# EAGLE design MO01 (EAGLE 6.3)
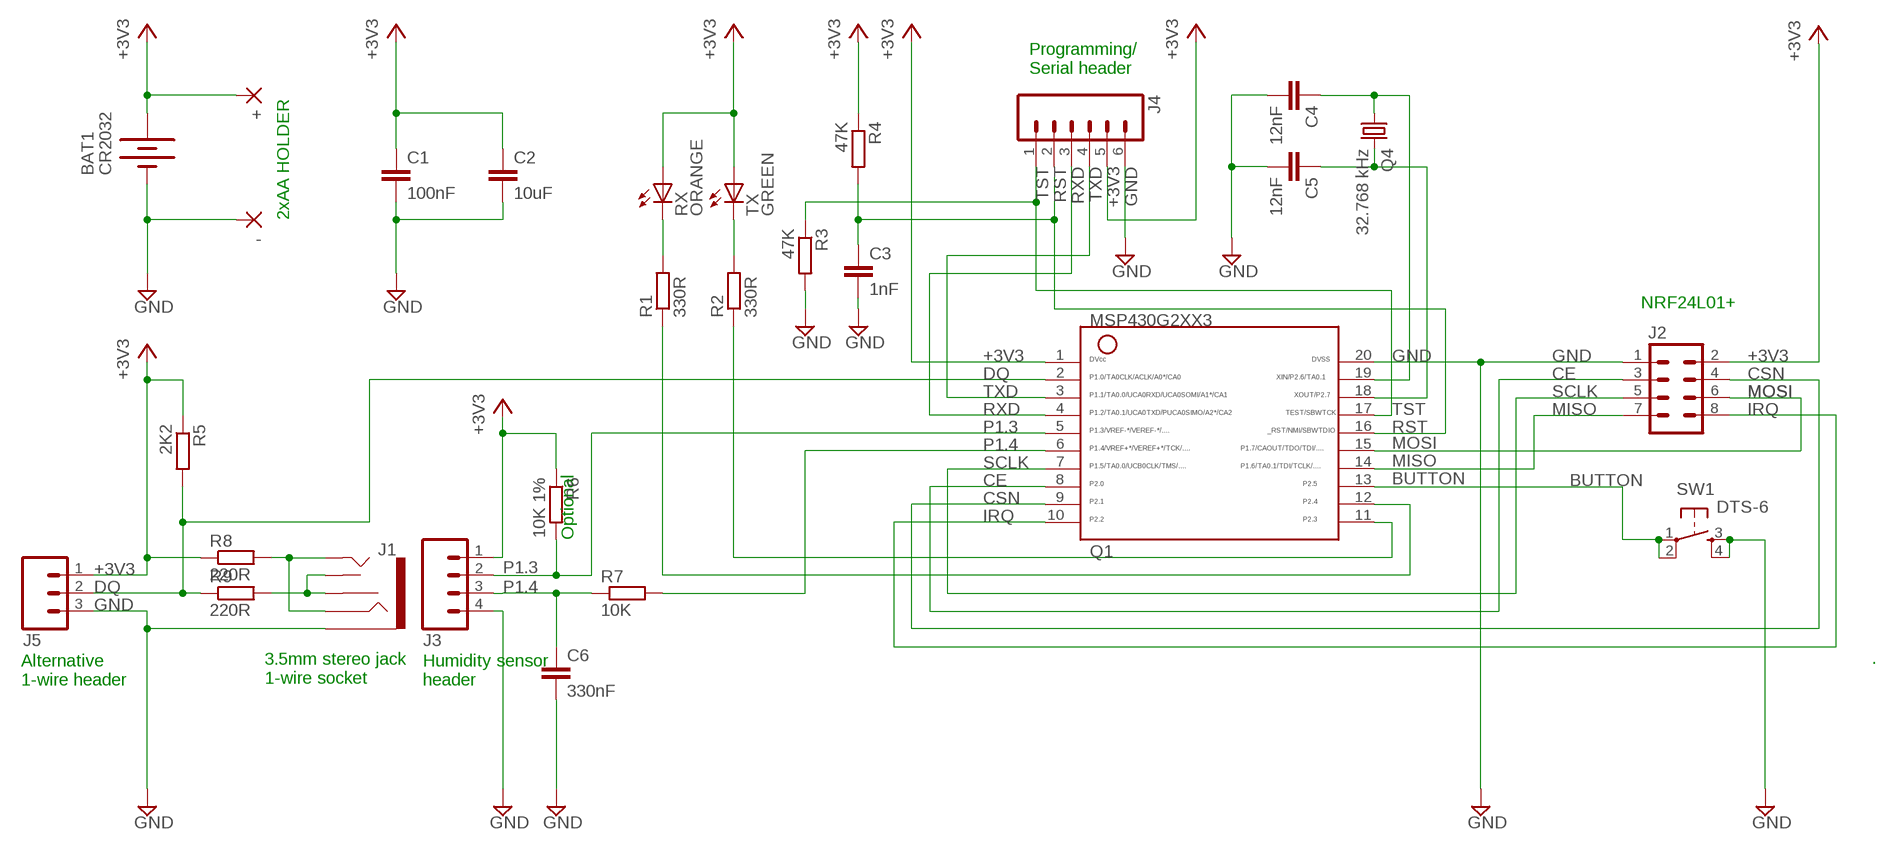
[diagram p0: schematic, sheet 1]

## Parts
+  2,54/1,0  [2,54/1,0]
-  2,54/1,0  [2,54/1,0]
BAT1  CR2032  BATTERY20PTH  [BATTCOM_20MM_PTH]
C1  100nF  C-EUC0805  [C0805]
C2  10uF  C-EUC1206  [C1206]
C3  1nF  C-EUC0805  [C0805]
C4  12nF  C-EUC0805  [C0805]
C5  12nF  C-EUC0805  [C0805]
C6  330nF  C-EUC0805  [C0805]
J1  AUDIO-JACK2PTH  [AUDIO-JACK]
J2  M04X2  [2X4]
J3  M04PTH  [1X04]
J4  M06SIP  [1X06]
J5  M03PTH  [1X03]
Q1  G2XX3---PW20  [PW20]
Q4  32.768 kHz  CRYSTALTC38H  [TC38H]
R1  330R  R-EU_M0805  [M0805]
R2  330R  R-EU_M0805  [M0805]
R3  47K  R-EU_M0805  [M0805]
R4  47K  R-EU_M0805  [M0805]
R5  2K2  R-EU_M0805  [M0805]
R6  10K 1%  R-EU_M0805  [M0805]
R7  10K  R-EU_M0805  [M0805]
R8  220R  R-EU_M0805  [M0805]
R9  220R  R-EU_M0805  [M0805]
RX  ORANGE  LEDCHIPLED_0805  [CHIPLED_0805]
SW1  DTS-6  [DTS-6]
TX  GREEN  LEDCHIPLED_0805  [CHIPLED_0805]

## Nets
+3V3: +.1(P) BAT1.1(+) C1.1 C2.1 J2.2 J3.1 J4.5 J5.1 Q1.1 R4.1 R5.1 R6.1 R8.1 RX.A TX.A
BUTTON: Q1.13 SW1.1 SW1.2
CE: J2.3 Q1.8
CSN: J2.4 Q1.9
DQ: J5.2 Q1.2 R5.2 R9.1
GND: -.1(P) BAT1.2(-) C1.2 C2.2 C3.2 C4.2 C5.2 C6.2 J1.SLEEVE J2.1 J3.4 J4.6 J5.3 Q1.20 R3.2 SW1.3 SW1.4
IRQ: J2.8 Q1.10
MISO: J2.7 Q1.14
MOSI: J2.6 Q1.15
N$1: R2.2 TX.C
N$2: R1.2 RX.C
N$3: Q1.11 R2.1
N$4: J1.RSH J1.TSH R9.2
N$5: Q1.12 R1.1
N$6: J1.RING J1.TIP R8.2
N$7: C6.1 J3.3 R7.1
P1.3: J3.2 Q1.5 R6.2
P1.4: Q1.6 R7.2
P2.6: C4.1 Q1.19 Q4.1
P2.7: C5.1 Q1.18 Q4.2
RST: C3.1 J4.2 Q1.16 R4.2
RXD: J4.3 Q1.4
SCLK: J2.5 Q1.7
TST: J4.1 Q1.17 R3.1
TXD: J4.4 Q1.3

## Notes on the sheet
- Programming/
  Serial header
- 2xAA HOLDER
- NRF24L01+
- Optional
- .
- 3.5mm stereo jack
  1-wire socket
- Alternative
  1-wire header
- Humidity sensor 
  header

## Library data of the parts
+ - = wirepad:2,54/1,0: THROUGH-HOLE PAD
BAT1 = SparkFun:BATTERY: Battery Holders Various common sizes : AA, AAA, 20mm coin cell and 12mm coin cell.
C1 C3-C6 = resistor:C-EU: CAPACITOR, European symbol
C2 = rcl:C-EU: CAPACITOR, European symbol
J1 = SparkFun-Connectors:AUDIO-JACK2: Stereo audio jack with bypass switches.
J2 = SparkFun:M04X2
J3 = SparkFun:M04: Header 4 Standard 4-pin 0.1" header. Use with straight break away headers (SKU : PRT-00116), right angle break away headers (PRT-00553), swiss pins (PRT-00743), machine pins (PRT-00117), and female headers (PRT-00115). Molex polarized connector foot print use with SKU : PRT-08231 with associated crimp pins and housings. 1MM SMD Version SKU: PRT-10208
J4 = SparkFun:M06: Header 6 Standard 6-pin 0.1" header. Use with straight break away headers (SKU : PRT-00116), right angle break away headers (PRT-00553), swiss pins (PRT-00743), machine pins (PRT-00117), and female headers (PRT-00115). Molex polarized connector foot print use with SKU : PRT-08094 with associated crimp pins and housings. NOTES ON THE VARIANTS LOCK and LOCK_LONGPADS... This footprint was designed to help hold the alignment of a through-hole component (i.e. 6-pin header) while soldering it into place. You may notice that each hole has been shifted either up or down by 0.005 of an inch from it's more standard position (which is a perfectly straight line). This slight alteration caused the pins (the squares in the middle) to touch the edges of the holes. Because they are alternating, it causes a "brace" to hold the component in place. 0.005 has proven to be the perfect amount of "off-center" position when using our standard breakaway headers. Although looks a little odd when you look at the bare footprint, once you have a header in there, the alteration is very hard to notice. Also, if you push a header all the way into place, it is covered up entirely on the bottom side. This idea of altering the position of holes to aid alignment will be further integrated into the Sparkfun Library for other footprints. It can help hold any component with 3 or more connection pins.
J5 = SparkFun:M03: Header 3 Standard 3-pin 0.1" header. Use with straight break away headers (SKU : PRT-00116), right angle break away headers (PRT-00553), swiss pins (PRT-00743), machine pins (PRT-00117), and female headers (PRT-00115). Molex polarized connector foot print use with SKU : PRT-08232 with associated crimp pins and housings.
Q1 = TI_MSP430_v16:G2XX3---PW20: MSP430G2XX1 TSSOP (PW) 20 Pin Package
Q4 = crystal:CRYSTAL: CRYSTAL; OC_FARNELL: unknown; OC_NEWARK: unknown
R1-R9 = resistor:R-EU_: RESISTOR, European symbol; RESISTANCE: 4K7
RX TX = led:LED: LED OSRAM: - CHIPLED LG R971, LG N971, LY N971, LG Q971, LY Q971, LO R971, LY R971 LH N974, LH R974 LS Q976, LO Q976, LY Q976 LO Q996 - Hyper CHIPLED LW Q18S LB Q993, LB Q99A, LB R99A - SideLED LS A670, LO A670, LY A670, LG A670, LP A670 LB A673, LV A673, LT A673, LW A673 LH A674 LY A675 LS A676, LA A676, LO A676, LY A676, LW A676 LS A679, LY A679, LG A679 - Hyper Micro SIDELED® LS Y876, LA Y876, LO Y876, LY Y876 LT Y87S - SmartLED LW L88C, LW L88S LB L89C, LB L89S, LG L890 LS L89K, LO L89K, LY L89K LS L896, LA L896, LO L896, LY L896 - TOPLED LS T670, LO T670, LY T670, LG T670, LP T670 LSG T670, LSP T670, LSY T670, LOP T670, LYG T670 LG T671, LOG T671, LSG T671 LB T673, LV T673, LT T673, LW T673 LH T674 LS T676, LA T676, LO T676, LY T676, LB T676, LH T676, LSB T676, LW T676 LB T67C, LV T67C, LT T67C, LS T67K, LO T67K, LY T67K, LW E67C LS E67B, LA E67B, LO E67B, LY E67B, LB E67C, LV E67C, LT E67C LW T67C LS T679, LY T679, LG T679 LS T770, LO T770, LY T770, LG T770, LP T770 LB T773, LV T773, LT T773, LW T773 LH T774 LS E675, LA E675, LY E675, LS T675 LS T776, LA T776, LO T776, LY T776, LB T776 LHGB T686 LT T68C, LB T68C - Hyper Mini TOPLED® LB M676 - Mini TOPLED Santana® LG M470 LS M47K, LO M47K, LY M47K Source: http://www.osram.convergy.de LUXEON: - LUMILED® LXK2-PW12-R00, LXK2-PW12-S00, LXK2-PW14-U00, LXK2-PW14-V00 LXK2-PM12-R00, LXK2-PM12-S00, LXK2-PM14-U00 LXK2-PE12-Q00, LXK2-PE12-R00, LXK2-PE12-S00, LXK2-PE14-T00, LXK2-PE14-U00 LXK2-PB12-K00, LXK2-PB12-L00, LXK2-PB12-M00, LXK2-PB14-N00, LXK2-PB14-P00, LXK2-PB14-Q00 LXK2-PR12-L00, LXK2-PR12-M00, LXK2-PR14-Q00, LXK2-PR14-R00 LXK2-PD12-Q00, LXK2-PD12-R00, LXK2-PD12-S00 LXK2-PH12-R00, LXK2-PH12-S00 LXK2-PL12-P00, LXK2-PL12-Q00, LXK2-PL12-R00 Source: www.luxeon.com KINGBRIGHT: KA-3528ASYC Source: www.kingbright.com
SW1 = switch-tact:DTS-6

## Board
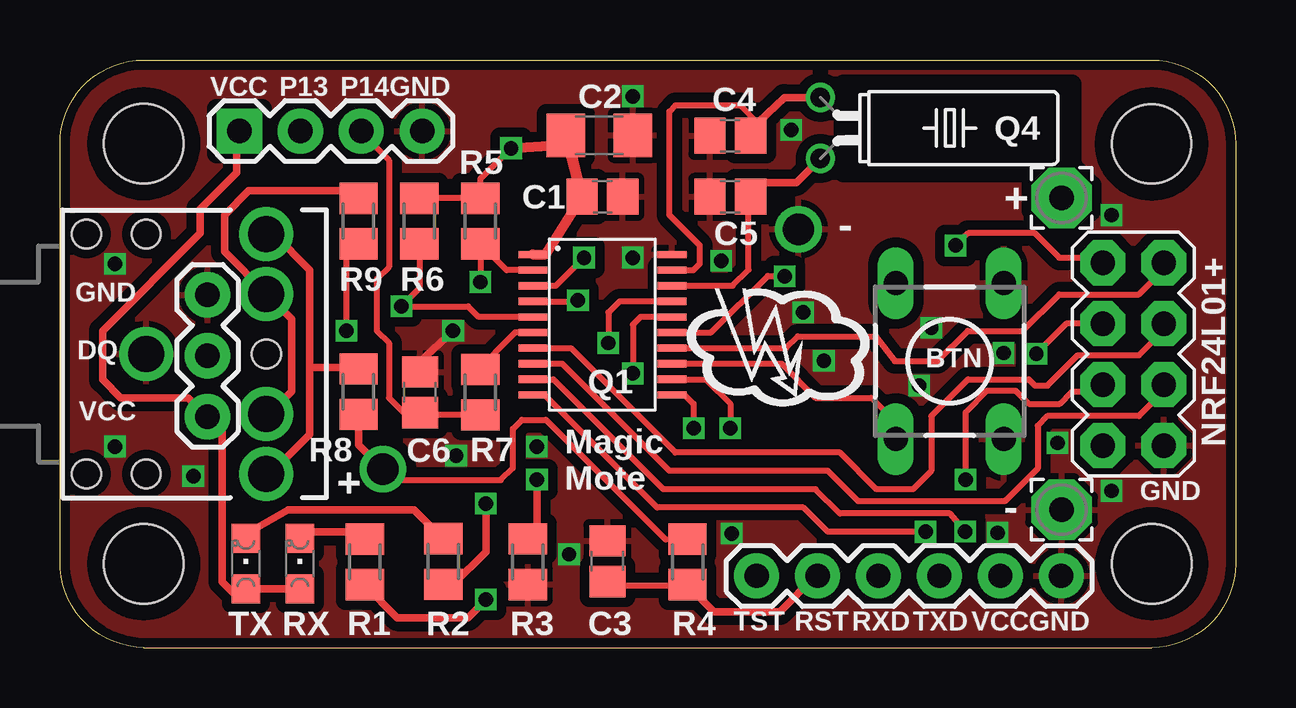
[diagram p1: board, top side]
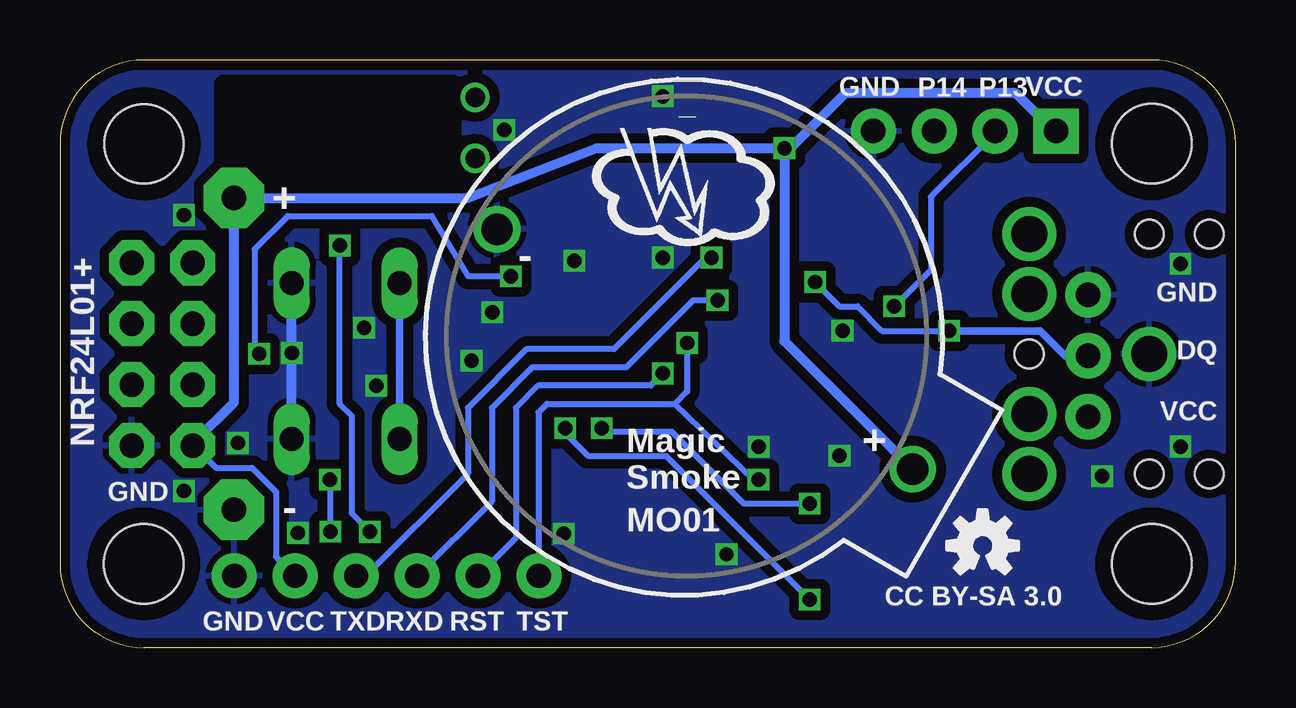
[diagram p2: board, bottom side, seen from below]

Size 49 x 24.5 mm. Coordinates in mm from the lower left corner, seen from the top.
Outline: 3.49,0 3.5,0
Outline: 3.5,0 45.5,0
Outline: 45.5,0 45.51,0
Outline: 0,3.49 0,3.6
Outline: 0,3.6 0,21
Outline: 0,21 0,21.01
Outline: 3.5,0 arc-90 0,3.6
Outline: 0,21 arc-90 3.5,24.5 45.5,24.5 arc-90 49,21 49,3.5 arc-90 45.5,0
Copper layers (1*2*15*16): Top 0.035mm / dielectric 0.2mm / layer 2 0.0175mm / dielectric 1.1mm / layer 15 0.0175mm / dielectric 0.2mm / Bottom 0.035mm
Design rules "SeeedStudio_DRU_no_angle_20130527": minimum track width 6mil, minimum drill 12mil, track to track 6mil, track to pad 6mil, pad to pad 6mil, via to via 6mil, smd to smd 0mil, copper to edge 10mil, drill to drill 10mil, minimum pad ring 6mil, minimum via ring 6mil, stop-mask expansion 2mil, vias tented up to drill 25mil, thermal gap 10mil
tRestrict: area 32.6,19.8 to 42.2,23.5
bRestrict: area 32.6,19.8 to 42.2,23.5

### Footprints (pad centres in the part's own frame; a part is rotated, then mirrored left to right if it is on the bottom)
2,54/1,0 = drill 1.016 pad 2.54 octagon: 1 0,0
BATTCOM_20MM_PTH = drill 1.3: 1 20,0; 2 0,0
C0805 = smd 1.3 x 1.5: 1 -0.85,0; 2 0.85,0
C1206 = smd 1.6 x 1.8: 1 -1.4,0; 2 1.4,0
AUDIO-JACK = drill 1.5 pad 2.184: RING 5,5; RSH 5,2.5; SLEEVE 0,0; TIP 5,-5; TSH 5,-2.5 | hole 1.2: 0,5; -2.5,5; -2.5,-5; 0,-5; 5,0
2X4 = drill 1.016 pad 1.88 octagon: 1 -3.81,-1.27; 2 -3.81,1.27; 3 -1.27,-1.27; 4 -1.27,1.27; 5 1.27,-1.27; 6 1.27,1.27; 7 3.81,-1.27; 8 3.81,1.27
1X04 = drill 1.016 pad 1.88 square: 1 0,0 | drill 1.016 pad 1.88: 2 2.54,0; 3 5.08,0; 4 7.62,0
1X06 = drill 1.016 pad 1.88: 1 0,0; 2 2.54,0; 3 5.08,0; 4 7.62,0; 5 10.16,0; 6 12.7,0
1X03 = drill 1.016 pad 1.88: 1 0,0; 2 2.54,0; 3 5.08,0
PW20 = smd 0.3 x 1.2: 1 -2.925,-2.9; 2 -2.275,-2.9; 3 -1.625,-2.9; 4 -0.975,-2.9; 5 -0.325,-2.9; 6 0.325,-2.9; 7 0.975,-2.9; 8 1.625,-2.9; 9 2.275,-2.9; 10 2.925,-2.9; 11 2.925,2.9; 12 2.275,2.9; 13 1.625,2.9; 14 0.975,2.9; 15 0.325,2.9; 16 -0.325,2.9; 17 -0.975,2.9; 18 -1.625,2.9; 19 -2.275,2.9; 20 -2.925,2.9
TC38H = drill 0.813: 1 -1.27,0; 2 1.27,0
M0805 = smd 1.3 x 1.6: 1 -0.95,0; 2 0.95,0
CHIPLED_0805 = smd 1.2 x 1.2: A 0,-1.05; C 0,1.05
DTS-6 = drill 1 long: 1 -3.25,2.25; 2 3.25,2.25; 3 -3.25,-2.25; 4 3.25,-2.25
STAND-OFF = hole 3.302: 0,0

### Placement (x,y rotation side)
+  41.75,18.75 0 top
-  41.75,5.75 0 top
BAT1  30.78,17.44 330 bottom
C1  22.61,18.8 0 top
C2  22.48,21.36 0 top
C3  22.82,3.6 90 top
C4  27.94,21.34 180 top
C5  27.94,18.8 180 top
C6  15,10.64 90 top
J1  3.6,12.24 0 top
J2  44.74,12.23 90 top
J3  7.48,21.54 0 top
J4  29.04,2.99 0 top
J5  6.15,9.63 90 top
Q1  22.61,13.46 270 top
Q4  31.7,21.66 270 top
R1  12.71,3.57 90 top
R2  15.97,3.59 90 top
R3  19.5,3.58 270 top
R4  26.16,3.57 270 top
R5  17.53,17.78 270 top
R6  14.99,17.78 270 top
R7  17.53,10.64 90 top
R8  12.45,10.67 90 top
R9  12.45,17.78 90 top
RX  10,3.5 0 top
SW1  37.08,11.94 90 top
TX  7.75,3.5 0 top
U$1  [OSHW-LOGO-S]  10.54,4.25 0 bottom
U$2  [STAND-OFF]  45.51,3.49 0 top
U$3  [STAND-OFF]  3.49,3.49 0 top
U$4  [STAND-OFF]  3.49,21.01 0 top
U$5  [STAND-OFF]  45.5,21 0 top

### Tracks (layer width: path | path; a pad name or v marks a point on that pad's centre or on a via)
+3V3  (via drill 0.6)
  Top 0.254: R4.1 25.25,4.5 20.25,9.5 19.25,9.5 18.88,9.12 18.88,7.49 18.37,6.98 14.02,6.98 BAT1.1 | R6.1 R5.1 17.53,19.54 v18.8,20.82
  Top 0.305: RX.A TX.A 7.71,2.7 7.3,2.2 6.75,2.75 6.75,9.02 J5.1 6.12,9.63 5.33,10.41 2.54,10.41 1.78,11.18 1.78,13.21 5.84,17.27 5.84,18.29 7.37,19.81 7.37,21.42 J3.1 | R8.1 12.45,8.45 BAT1.1
  Top 0.406: 20.58,20.82 20.7,20.95 | 20.7,20.95 C2.1 21.15,21.36 | Q1.1 20.23,16.39 C1.1 21.15,21.36 | 21.08,21.34 21.65,19.11 21.14,21.35 21.15,21.36 | v18.8,20.82 20.7,20.95
  Bottom 0.254: 43.42,8.38 43.38,8.38 42.5,7.5 41,7.5 40,6.5 40,3.79 J4.5
  Bottom 0.406: J2.2 43.42,8.38 43.42,8.55 41.75,10.22 +.1 32.01,18.75 26.64,20.82 v18.8,20.82 | J3.1 7.58,21.54 9.15,23.11 16.26,23.11 18.55,20.82 v18.8,20.82 | v18.8,20.82 18.8,12.78 BAT1.1
BUTTON
  Top 0.254: Q1.13 30.07,11.84 31.5,10.41 33.82,10.41 34.83,9.4 SW1.1 | 34.83,13.97 SW1.2
  Bottom 0.305: SW1.2 SW1.1
CE
  Top 0.254: J2.3 46.01,10.69 44.97,9.65 41.15,9.65 40.75,9.25 40.75,7.47 39.38,6.1 | Q1.8 20.93,11.84 25.4,7.37 32,7.37 33.27,6.1 39.38,6.1 | 39.38,6.1 39.38,6.13
CSN  (via drill 0.6)
  Top 0.254: Q1.9 20.56,11.19 25.15,6.6 31.5,6.6 32.51,5.59 37.1,5.59 v37.73,4.83 | J2.4 43.42,10.67 42.18,10.67 41.67,10.16 40.39,10.16 39.83,10.71 38.65,10.71 37.75,9.81 v37.75,7
  Bottom 0.254: v37.75,7 37.75,4.85 v37.73,4.83
DQ  (via drill 0.6)
  Top 0.254: Q1.2 18.62,15.74 R5.2 v17.53,15.24 | v11.94,13.21 11.94,16.26 12.7,17.02 12.7,16.83 R9.1
  Bottom 0.254: v17.53,15.24 16.51,14.22 15.75,14.22 14.73,13.21 v11.94,13.21
  Bottom 0.305: J5.2 7.09,12.17 8.13,13.21 v11.94,13.21
GND  (via drill 0.6)
  Top 0.254: C6.2 15,11.92
  Top 0.305: 15,11.92 v16.38,13.21
  Bottom 0.305: 39.37,8.65 SW1.3
  Bottom 0.406: SW1.3 SW1.4
  other vias: 2.29,8.38 2.29,16 21.22,3.88 30.98,13.98 23.88,16.26 28,4.75 27.56,16.13 35.81,10.92 36.32,13.34 30.48,21.58 43.83,18.03 31.84,11.95 23.88,22.99 5.56,7.14 19.88,8.37 39.33,12.28 41.58,8.53 43.83,6.53 39.08,4.78 16.51,8
  pour Top (isolate 0.406): 51.05,25.41 51.05,-1.02 -1.02,-1.02 -1,25.5
  pour Bottom (isolate 0.406): -0.5,25 50.5,25 50.55,-0.51 -0.51,-0.51
IRQ  (via drill 0.6)
  Top 0.254: v37.34,16.76 37.85,17.27 40.64,17.27 41.66,16.26 43.01,16.26 J2.8 | v36.08,4.83 32,4.83 30.99,5.84 24.89,5.84 20.2,10.54 Q1.10
  Bottom 0.254: v36.08,4.83 36.83,5.58 36.83,9.65 37.34,10.16 v37.34,16.76
MISO
  Top 0.254: J2.7 46.01,15.77 44.97,14.73 41.65,14.73 40.12,13.2 37.84,13.2 36.58,11.94 34.8,11.94 34.02,12.97 30.75,12.97 30.27,12.49 Q1.14
MOSI  (via drill 0.6)
  Top 0.254: J2.6 41.95,13.5 v40.7,12.25 | v30.21,15.48 29.52,15.48 29.5,15.5 27.14,13.14 Q1.15
  Bottom 0.254: v40.7,12.25 40.89,12.45 40.89,16.61 39.5,18 33.5,18 31.98,15.48 v30.21,15.48
N$1
  Top 0.305: TX.C 7.75,4.75 9.5,5.75 14.76,5.75 R2.2
N$2
  Top 0.305: RX.C 10.58,4.83 12.88,4.83 R1.2
N$3  (via drill 0.6)
  Top 0.254: Q1.11 26.04,10.54 26.42,10.16 v26.42,9.14
  Top 0.305: 15.89,2.64 R2.1 16.39,2.64 17.75,4 v17.75,6
  Bottom 0.254: v17.75,6 20.5,6 23.5,9 26.27,9 v26.42,9.14
N$4
  Top 0.305: J1.TSH 8.72,9.74 9.65,10.67 9.65,13.69 J1.RSH 8.6,14.77 6.86,16.51 6.86,18.03 7.87,19.05 12.13,19.05 R9.2
N$5  (via drill 0.6)
  Top 0.254: 13.17,2.55 R1.1 | Q1.12 26.91,11.19 27.94,10.16 v27.94,9.14
  Top 0.305: R1.1 14.05,1.25 17,1.25 v17.75,2
  Bottom 0.254: v17.75,2 23.75,8 27,8 27.94,8.94 v27.94,9.14
N$6
  Top 0.305: J1.TIP 8.76,7.24 10.41,8.89 10.41,11.68 | R8.2 12.38,11.68 10.41,11.68 | J1.RING 8.92,17.24 10.41,15.75 10.41,11.68
N$7
  Top 0.254: R7.1 15.1,9.69 C6.1 14.86,9.65 14.48,9.65 13.72,10.41 13.72,12.7 13.21,13.21 13.21,15.37 13.72,15.88 13.72,20.32 12.56,21.48 J3.3
P1.3  (via drill 0.6)
  Top 0.254: R6.2 14.99,14.99 v14.22,14.22 17.02,14.22 17.45,13.79 Q1.5
  Bottom 0.254: J3.2 10.02,21.48 12.7,18.8 12.7,15.75 v14.22,14.22
P1.4
  Top 0.254: Q1.6 18.98,13.14 17.27,11.43 R7.2
P2.6
  Top 0.254: Q1.19 26.41,15.74 26.67,16 26.67,16.76 25.4,18.03 25.4,22.35 25.65,22.61 28.36,22.61 29.1,21.87
  Top 0.305: C4.1 29.1,21.87 29.13,21.93 30.2,22.93 Q4.1
P2.7
  Top 0.254: 28.7,18.71 28.7,15.75 28.04,15.09 Q1.18
  Top 0.305: 28.7,18.71 C5.1 29.13,19.39 30.7,19.39 Q4.2
RST  (via drill 0.6)
  Top 0.254: Q1.16 24.2,13.79 23.88,13.46 v23.88,11.43 | 22.92,2.6 26.13,2.6 R4.2
  Top 0.305: J4.2 31.49,2.99 30,1.5 27.26,1.5 R4.2 | 22.92,2.6 C3.1
  Bottom 0.254: v23.88,11.43 24.38,10.92 29.08,10.92 30,10 30,4.56 J4.2
RXD  (via drill 0.6)
  Top 0.254: Q1.4 21.8,14.44 v21.59,14.48
  Bottom 0.254: v21.59,14.48 22.61,14.48 25.4,11.68 29.32,11.68 31,10 31,6.1 J4.3
SCLK
  Top 0.254: J2.5 46.01,13.23 44.97,12.19 42.43,12.19 41.16,10.92 40.64,10.92 40.38,11.18 37.85,11.18 36.32,9.65 36.32,7.37 35.56,6.6 34.04,6.6 32.51,8.13 25.65,8.13 21.3,12.49 Q1.7
TST  (via drill 0.6)
  Top 0.254: Q1.17 23.33,14.44 22.86,13.97 v22.86,12.7
  Top 0.305: 19.81,4.83 19.51,4.53 R3.1 19.88,5.03 v19.88,7
  Bottom 0.254: v22.86,12.7 22.86,10.67 23.37,10.16 | 23.37,10.16 28.7,10.16 29.06,9.81 29.06,3.01 J4.1 | v19.88,7 20.08,7 23.37,10.16
TXD  (via drill 0.6)
  Top 0.254: Q1.3 20.68,15.09 v21.84,16.26
  Bottom 0.254: v21.84,16.26 22.1,16.26 25.91,12.45 29.55,12.45 32,10 32,7.25 36.26,2.99 J4.4

### Text on the board
tPlace: Magic / Mote
bPlace: Magic / Smoke | MO01 | CC BY-SA 3.0
tNames: VCC | P13 | P14 | GND | - | NRF24L01+ | GND | DQ | BTN | VCC | + | GND | TST | RST | RXD | TXD | VCC | GND
bNames: VCC | P13 | P14 | GND | + | - | NRF24L01+ | GND | DQ | VCC | + | - | GND | TST | RST | RXD | TXD | VCC | GND